# EAGLE design untitled (EAGLE 6.1)
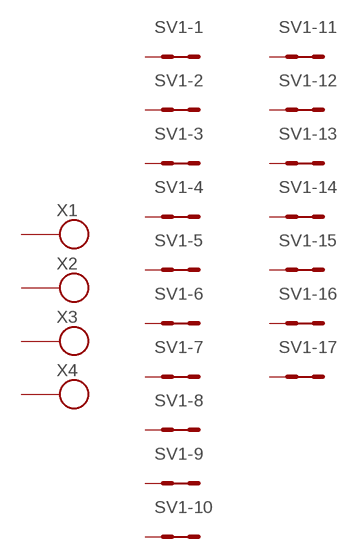
[diagram p0: schematic, sheet 1]

## Parts
SV1  MA17-2  [MA17-2]
X1  SROUB3M  [SROUB3M]
X2  SROUB3M  [SROUB3M]
X3  SROUB3M  [SROUB3M]
X4  SROUB3M  [SROUB3M]
Unconnected: SV1.1 SV1.2 SV1.3 SV1.4 SV1.5 SV1.6 SV1.7 SV1.8 SV1.9 SV1.10 SV1.11 SV1.12 SV1.13 SV1.14 SV1.15 SV1.16 SV1.17 SV1.18 SV1.19 SV1.20 SV1.21 SV1.22 SV1.23 SV1.24 SV1.25 SV1.26 SV1.27 SV1.28 SV1.29 SV1.30 SV1.31 SV1.32 SV1.33 SV1.34 X1.P$1 X2.P$1 X3.P$1 X4.P$1

## Library data of the parts
SV1 = moje_hrebinky:MA17-2: PIN HEADER; OC_FARNELL: unknown; OC_NEWARK: unknown
X1-X4 = moje:SROUB3M

## Board
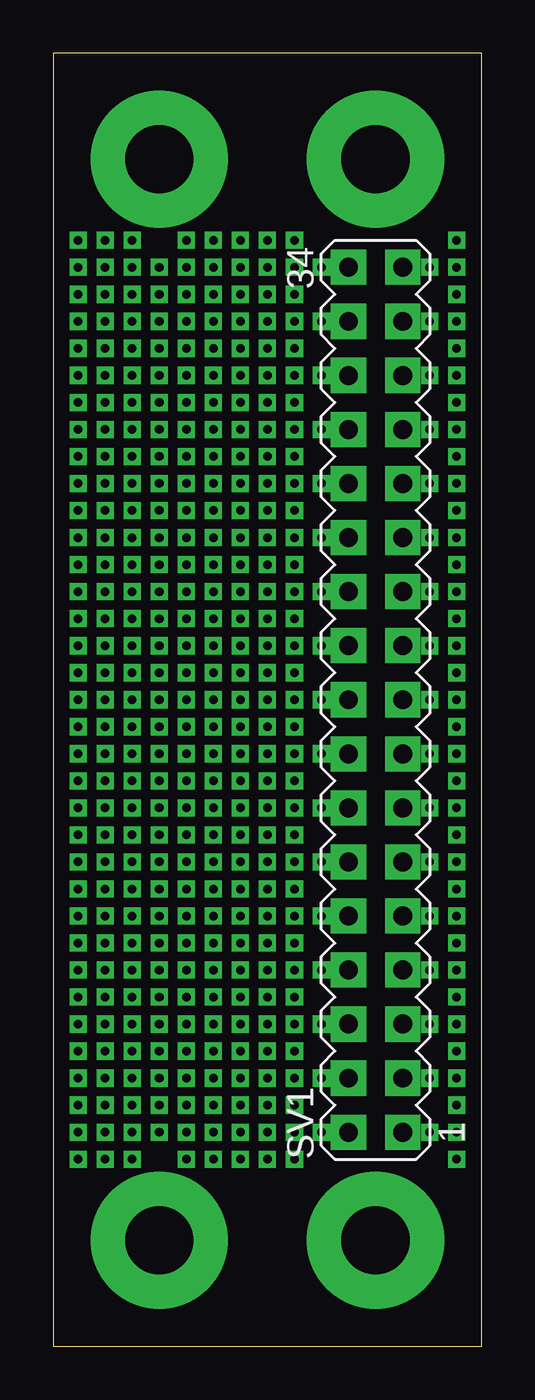
[diagram p1: board, top side]
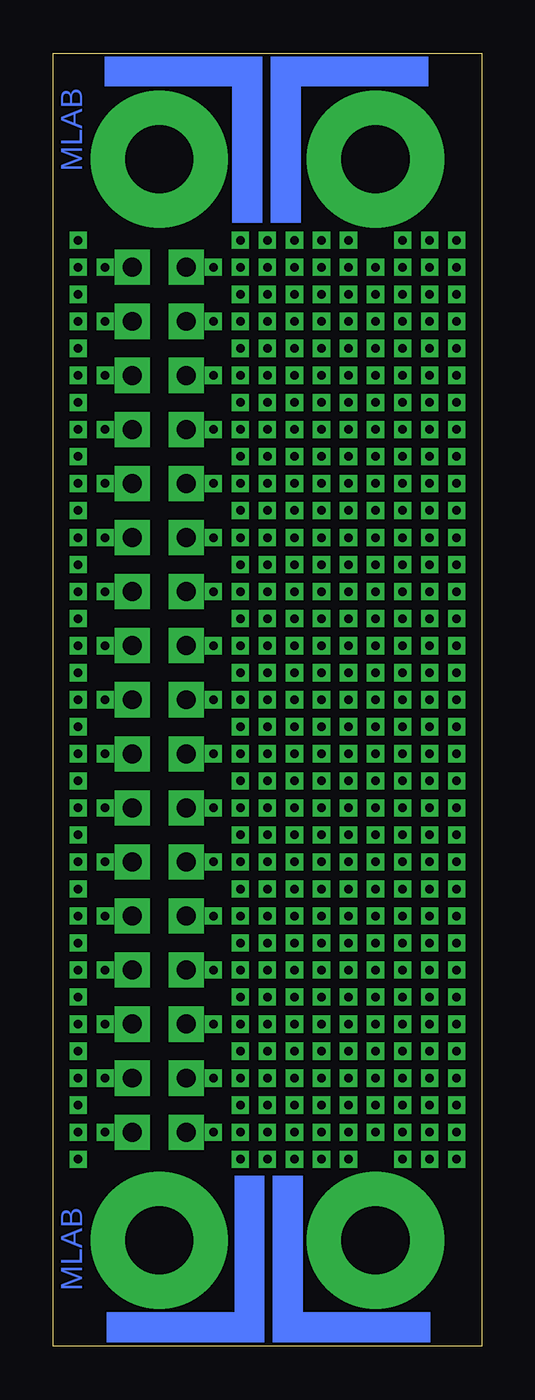
[diagram p2: board, bottom side, seen from below]

Size 20.12 x 60.76 mm. Coordinates in mm from the lower left corner, seen from the top.
Outline: 0,0 20.12,0 20.12,60.76 0,60.76 0,0
Copper layers (1*16): Top 0.035mm / dielectric 1.5mm / Bottom 0.035mm
Design rules: minimum track width 10mil, minimum drill 24mil, track to track 8mil, track to pad 8mil, pad to pad 8mil, via to via 8mil, smd to smd 8mil, copper to edge 40mil, drill to drill 8mil, minimum pad ring 10mil, minimum via ring 8mil, stop-mask expansion 4mil, vias tented up to drill 0mil, thermal gap 10mil

### Footprints (pad centres in the part's own frame; a part is rotated, then mirrored left to right if it is on the bottom)
MA17-2 = drill 0.889 pad 1.651 square: 1 -20.32,-1.27; 2 -20.32,1.27; 3 -17.78,-1.27; 4 -17.78,1.27; 5 -15.24,-1.27; 6 -15.24,1.27; 7 -12.7,-1.27; 8 -12.7,1.27; 9 -10.16,-1.27; 10 -10.16,1.27; 11 -7.62,-1.27; 12 -7.62,1.27; 13 -5.08,-1.27; 14 -5.08,1.27; 15 -2.54,-1.27; 16 -2.54,1.27; 17 0,-1.27; 18 0,1.27; 19 2.54,-1.27; 20 2.54,1.27; 21 5.08,-1.27; 22 5.08,1.27; 23 7.62,-1.27; 24 7.62,1.27; 25 10.16,-1.27; 26 10.16,1.27; 27 12.7,-1.27; 28 12.7,1.27; 29 15.24,-1.27; 30 15.24,1.27; 31 17.78,-1.27; 32 17.78,1.27; 33 20.32,-1.27; 34 20.32,1.27
SROUB3M = drill 3.2 pad 6.452: P$1 0,0

### Placement (x,y rotation side)
SV1  15.14,30.38 90 top
X1  15.14,4.98 0 top
X2  15.14,55.78 0 top
X3  4.98,4.98 0 top
X4  4.98,55.78 0 top

### Tracks (layer width: path | path; a pad name or v marks a point on that pad's centre or on a via)
N$1  (via drill 0.4)
  other vias: 3.71,8.79
N$2  (via drill 0.4)
  other vias: 6.25,8.79
N$3  (via drill 0.4)
  other vias: 7.52,8.79
N$4  (via drill 0.4)
  other vias: 8.79,8.79
N$5  (via drill 0.4)
  other vias: 10.06,8.79
N$6  (via drill 0.4)
  other vias: 11.33,8.79
N$7  (via drill 0.4)
  other vias: 11.33,10.06
N$8  (via drill 0.4)
  other vias: 10.06,10.06
N$9  (via drill 0.4)
  other vias: 8.79,10.06
N$10  (via drill 0.4)
  other vias: 1.17,8.79
N$11  (via drill 0.4)
  other vias: 2.44,8.79
N$12  (via drill 0.4)
  other vias: 7.52,10.06
N$13  (via drill 0.4)
  other vias: 6.25,10.06
N$14  (via drill 0.4)
  other vias: 4.98,10.06
N$15  (via drill 0.4)
  other vias: 3.71,10.06
N$16  (via drill 0.4)
  other vias: 2.44,10.06
N$17  (via drill 0.4)
  other vias: 1.17,10.06
N$18  (via drill 0.4)
  other vias: 1.17,11.33
N$19  (via drill 0.4)
  other vias: 2.44,11.33
N$20  (via drill 0.4)
  other vias: 3.71,11.33
N$21  (via drill 0.4)
  other vias: 4.98,11.33
N$22  (via drill 0.4)
  other vias: 6.25,11.33
N$23  (via drill 0.4)
  other vias: 7.52,11.33
N$24  (via drill 0.4)
  other vias: 8.79,11.33
N$25  (via drill 0.4)
  other vias: 10.06,11.33
N$26  (via drill 0.4)
  other vias: 11.33,11.33
N$27  (via drill 0.4)
  other vias: 11.33,12.6
N$28  (via drill 0.4)
  other vias: 10.06,12.6
N$29  (via drill 0.4)
  other vias: 8.79,12.6
N$30  (via drill 0.4)
  other vias: 7.52,12.6
N$31  (via drill 0.4)
  other vias: 4.98,12.6
N$32  (via drill 0.4)
  other vias: 6.25,12.6
N$33  (via drill 0.4)
  other vias: 3.71,12.6
N$34  (via drill 0.4)
  other vias: 2.44,12.6
N$35  (via drill 0.4)
  other vias: 1.17,12.6
N$36  (via drill 0.4)
  other vias: 12.6,12.6
N$37  (via drill 0.4)
  other vias: 12.6,10.06
N$38  (via drill 0.4)
  other vias: 11.33,13.87
N$39  (via drill 0.4)
  other vias: 10.06,13.87
N$40  (via drill 0.4)
  other vias: 8.79,13.87
N$41  (via drill 0.4)
  other vias: 7.52,13.87
N$42  (via drill 0.4)
  other vias: 6.25,13.87
N$43  (via drill 0.4)
  other vias: 3.71,13.87
N$44  (via drill 0.4)
  other vias: 4.98,13.87
N$45  (via drill 0.4)
  other vias: 2.44,13.87
N$46  (via drill 0.4)
  other vias: 1.17,13.87
N$47  (via drill 0.4)
  other vias: 11.33,15.14
N$48  (via drill 0.4)
  other vias: 10.06,15.14
N$49  (via drill 0.4)
  other vias: 8.79,15.14
N$50  (via drill 0.4)
  other vias: 7.52,15.14
N$51  (via drill 0.4)
  other vias: 6.25,15.14
N$52  (via drill 0.4)
  other vias: 4.98,15.14
N$53  (via drill 0.4)
  other vias: 3.71,15.14
N$54  (via drill 0.4)
  other vias: 2.44,15.14
N$55  (via drill 0.4)
  other vias: 1.17,15.14
N$56  (via drill 0.4)
  other vias: 1.17,16.41
N$57  (via drill 0.4)
  other vias: 2.44,16.41
N$58  (via drill 0.4)
  other vias: 3.71,16.41
N$59  (via drill 0.4)
  other vias: 4.98,16.41
N$60  (via drill 0.4)
  other vias: 6.25,16.41
N$61  (via drill 0.4)
  other vias: 7.52,16.41
N$62  (via drill 0.4)
  other vias: 8.79,16.41
N$63  (via drill 0.4)
  other vias: 10.06,16.41
N$64  (via drill 0.4)
  other vias: 11.33,16.41
N$65  (via drill 0.4)
  other vias: 11.33,17.68
N$66  (via drill 0.4)
  other vias: 10.06,17.68
N$67  (via drill 0.4)
  other vias: 8.79,17.68
N$68  (via drill 0.4)
  other vias: 7.52,17.68
N$69  (via drill 0.4)
  other vias: 4.98,17.68
N$70  (via drill 0.4)
  other vias: 6.25,17.68
N$71  (via drill 0.4)
  other vias: 3.71,17.68
N$72  (via drill 0.4)
  other vias: 2.44,17.68
N$73  (via drill 0.4)
  other vias: 1.17,17.68
N$74  (via drill 0.4)
  other vias: 12.6,17.68
N$75  (via drill 0.4)
  other vias: 12.6,15.14
N$76  (via drill 0.4)
  other vias: 11.33,18.95
N$77  (via drill 0.4)
  other vias: 10.06,18.95
N$78  (via drill 0.4)
  other vias: 8.79,18.95
N$79  (via drill 0.4)
  other vias: 7.52,18.95
N$80  (via drill 0.4)
  other vias: 6.25,18.95
N$81  (via drill 0.4)
  other vias: 3.71,18.95
N$82  (via drill 0.4)
  other vias: 4.98,18.95
N$83  (via drill 0.4)
  other vias: 2.44,18.95
N$84  (via drill 0.4)
  other vias: 1.17,18.95
N$85  (via drill 0.4)
  other vias: 11.33,20.22
N$86  (via drill 0.4)
  other vias: 10.06,20.22
N$87  (via drill 0.4)
  other vias: 8.79,20.22
N$88  (via drill 0.4)
  other vias: 7.52,20.22
N$89  (via drill 0.4)
  other vias: 6.25,20.22
N$90  (via drill 0.4)
  other vias: 4.98,20.22
N$91  (via drill 0.4)
  other vias: 3.71,20.22
N$92  (via drill 0.4)
  other vias: 2.44,20.22
N$93  (via drill 0.4)
  other vias: 1.17,20.22
N$94  (via drill 0.4)
  other vias: 1.17,21.49
N$95  (via drill 0.4)
  other vias: 2.44,21.49
N$96  (via drill 0.4)
  other vias: 3.71,21.49
N$97  (via drill 0.4)
  other vias: 4.98,21.49
N$98  (via drill 0.4)
  other vias: 6.25,21.49
N$99  (via drill 0.4)
  other vias: 7.52,21.49
N$100  (via drill 0.4)
  other vias: 8.79,21.49
N$101  (via drill 0.4)
  other vias: 10.06,21.49
N$102  (via drill 0.4)
  other vias: 11.33,21.49
N$103  (via drill 0.4)
  other vias: 11.33,22.76
N$104  (via drill 0.4)
  other vias: 10.06,22.76
N$105  (via drill 0.4)
  other vias: 8.79,22.76
N$106  (via drill 0.4)
  other vias: 7.52,22.76
N$107  (via drill 0.4)
  other vias: 4.98,22.76
N$108  (via drill 0.4)
  other vias: 6.25,22.76
N$109  (via drill 0.4)
  other vias: 3.71,22.76
N$110  (via drill 0.4)
  other vias: 2.44,22.76
N$111  (via drill 0.4)
  other vias: 1.17,22.76
N$112  (via drill 0.4)
  other vias: 12.6,22.76
N$113  (via drill 0.4)
  other vias: 12.6,20.22
N$114  (via drill 0.4)
  other vias: 11.33,24.03
N$115  (via drill 0.4)
  other vias: 10.06,24.03
N$116  (via drill 0.4)
  other vias: 8.79,24.03
N$117  (via drill 0.4)
  other vias: 7.52,24.03
N$118  (via drill 0.4)
  other vias: 6.25,24.03
N$119  (via drill 0.4)
  other vias: 3.71,24.03
N$120  (via drill 0.4)
  other vias: 4.98,24.03
N$121  (via drill 0.4)
  other vias: 2.44,24.03
N$122  (via drill 0.4)
  other vias: 1.17,24.03
N$123  (via drill 0.4)
  other vias: 11.33,25.3
N$124  (via drill 0.4)
  other vias: 10.06,25.3
N$125  (via drill 0.4)
  other vias: 8.79,25.3
N$126  (via drill 0.4)
  other vias: 7.52,25.3
N$127  (via drill 0.4)
  other vias: 6.25,25.3
N$128  (via drill 0.4)
  other vias: 4.98,25.3
N$129  (via drill 0.4)
  other vias: 3.71,25.3
N$130  (via drill 0.4)
  other vias: 2.44,25.3
N$131  (via drill 0.4)
  other vias: 1.17,25.3
N$132  (via drill 0.4)
  other vias: 1.17,26.57
N$133  (via drill 0.4)
  other vias: 2.44,26.57
N$134  (via drill 0.4)
  other vias: 3.71,26.57
N$135  (via drill 0.4)
  other vias: 4.98,26.57
N$136  (via drill 0.4)
  other vias: 6.25,26.57
N$137  (via drill 0.4)
  other vias: 7.52,26.57
N$138  (via drill 0.4)
  other vias: 8.79,26.57
N$139  (via drill 0.4)
  other vias: 10.06,26.57
N$140  (via drill 0.4)
  other vias: 11.33,26.57
N$141  (via drill 0.4)
  other vias: 11.33,27.84
N$142  (via drill 0.4)
  other vias: 10.06,27.84
N$143  (via drill 0.4)
  other vias: 8.79,27.84
N$144  (via drill 0.4)
  other vias: 7.52,27.84
N$145  (via drill 0.4)
  other vias: 4.98,27.84
N$146  (via drill 0.4)
  other vias: 6.25,27.84
N$147  (via drill 0.4)
  other vias: 3.71,27.84
N$148  (via drill 0.4)
  other vias: 2.44,27.84
N$149  (via drill 0.4)
  other vias: 1.17,27.84
N$150  (via drill 0.4)
  other vias: 12.6,27.84
N$151  (via drill 0.4)
  other vias: 12.6,25.3
N$152  (via drill 0.4)
  other vias: 11.33,29.11
N$153  (via drill 0.4)
  other vias: 10.06,29.11
N$154  (via drill 0.4)
  other vias: 8.79,29.11
N$155  (via drill 0.4)
  other vias: 7.52,29.11
N$156  (via drill 0.4)
  other vias: 6.25,29.11
N$157  (via drill 0.4)
  other vias: 3.71,29.11
N$158  (via drill 0.4)
  other vias: 4.98,29.11
N$159  (via drill 0.4)
  other vias: 2.44,29.11
N$160  (via drill 0.4)
  other vias: 1.17,29.11
N$161  (via drill 0.4)
  other vias: 11.33,30.38
N$162  (via drill 0.4)
  other vias: 10.06,30.38
N$163  (via drill 0.4)
  other vias: 8.79,30.38
N$164  (via drill 0.4)
  other vias: 7.52,30.38
N$165  (via drill 0.4)
  other vias: 6.25,30.38
N$166  (via drill 0.4)
  other vias: 4.98,30.38
N$167  (via drill 0.4)
  other vias: 3.71,30.38
N$168  (via drill 0.4)
  other vias: 2.44,30.38
N$169  (via drill 0.4)
  other vias: 1.17,30.38
N$170  (via drill 0.4)
  other vias: 1.17,31.65
N$171  (via drill 0.4)
  other vias: 2.44,31.65
N$172  (via drill 0.4)
  other vias: 3.71,31.65
N$173  (via drill 0.4)
  other vias: 4.98,31.65
N$174  (via drill 0.4)
  other vias: 6.25,31.65
N$175  (via drill 0.4)
  other vias: 7.52,31.65
N$176  (via drill 0.4)
  other vias: 8.79,31.65
N$177  (via drill 0.4)
  other vias: 10.06,31.65
N$178  (via drill 0.4)
  other vias: 11.33,31.65
N$179  (via drill 0.4)
  other vias: 11.33,32.92
N$180  (via drill 0.4)
  other vias: 10.06,32.92
N$181  (via drill 0.4)
  other vias: 8.79,32.92
N$182  (via drill 0.4)
  other vias: 7.52,32.92
N$183  (via drill 0.4)
  other vias: 4.98,32.92
N$184  (via drill 0.4)
  other vias: 6.25,32.92
N$185  (via drill 0.4)
  other vias: 3.71,32.92
N$186  (via drill 0.4)
  other vias: 2.44,32.92
N$187  (via drill 0.4)
  other vias: 1.17,32.92
N$188  (via drill 0.4)
  other vias: 12.6,32.92
N$189  (via drill 0.4)
  other vias: 12.6,30.38
N$190  (via drill 0.4)
  other vias: 11.33,34.19
N$191  (via drill 0.4)
  other vias: 10.06,34.19
N$192  (via drill 0.4)
  other vias: 8.79,34.19
N$193  (via drill 0.4)
  other vias: 7.52,34.19
N$194  (via drill 0.4)
  other vias: 6.25,34.19
N$195  (via drill 0.4)
  other vias: 3.71,34.19
N$196  (via drill 0.4)
  other vias: 4.98,34.19
N$197  (via drill 0.4)
  other vias: 2.44,34.19
N$198  (via drill 0.4)
  other vias: 1.17,34.19
N$199  (via drill 0.4)
  other vias: 11.33,35.46
N$200  (via drill 0.4)
  other vias: 10.06,35.46
N$201  (via drill 0.4)
  other vias: 8.79,35.46
N$202  (via drill 0.4)
  other vias: 7.52,35.46
N$203  (via drill 0.4)
  other vias: 6.25,35.46
N$204  (via drill 0.4)
  other vias: 4.98,35.46
N$205  (via drill 0.4)
  other vias: 3.71,35.46
N$206  (via drill 0.4)
  other vias: 2.44,35.46
N$207  (via drill 0.4)
  other vias: 1.17,35.46
N$208  (via drill 0.4)
  other vias: 1.17,36.73
N$209  (via drill 0.4)
  other vias: 2.44,36.73
N$210  (via drill 0.4)
  other vias: 3.71,36.73
N$211  (via drill 0.4)
  other vias: 4.98,36.73
N$212  (via drill 0.4)
  other vias: 6.25,36.73
N$213  (via drill 0.4)
  other vias: 7.52,36.73
N$214  (via drill 0.4)
  other vias: 8.79,36.73
N$215  (via drill 0.4)
  other vias: 10.06,36.73
N$216  (via drill 0.4)
  other vias: 11.33,36.73
N$217  (via drill 0.4)
  other vias: 11.33,38
N$218  (via drill 0.4)
  other vias: 10.06,38
N$219  (via drill 0.4)
  other vias: 8.79,38
N$220  (via drill 0.4)
  other vias: 7.52,38
N$221  (via drill 0.4)
  other vias: 4.98,38
N$222  (via drill 0.4)
  other vias: 6.25,38
N$223  (via drill 0.4)
  other vias: 3.71,38
N$224  (via drill 0.4)
  other vias: 2.44,38
N$225  (via drill 0.4)
  other vias: 1.17,38
N$226  (via drill 0.4)
  other vias: 12.6,38
N$227  (via drill 0.4)
  other vias: 12.6,35.46
N$228  (via drill 0.4)
  other vias: 11.33,39.27
N$229  (via drill 0.4)
  other vias: 10.06,39.27
N$230  (via drill 0.4)
  other vias: 8.79,39.27
N$231  (via drill 0.4)
  other vias: 7.52,39.27
N$232  (via drill 0.4)
  other vias: 6.25,39.27
N$233  (via drill 0.4)
  other vias: 3.71,39.27
N$234  (via drill 0.4)
  other vias: 4.98,39.27
N$235  (via drill 0.4)
  other vias: 2.44,39.27
N$236  (via drill 0.4)
  other vias: 1.17,39.27
N$237  (via drill 0.4)
  other vias: 11.33,40.54
N$238  (via drill 0.4)
  other vias: 10.06,40.54
N$239  (via drill 0.4)
  other vias: 8.79,40.54
N$240  (via drill 0.4)
  other vias: 7.52,40.54
N$241  (via drill 0.4)
  other vias: 6.25,40.54
N$242  (via drill 0.4)
  other vias: 4.98,40.54
N$243  (via drill 0.4)
  other vias: 3.71,40.54
N$244  (via drill 0.4)
  other vias: 2.44,40.54
N$245  (via drill 0.4)
  other vias: 1.17,40.54
N$246  (via drill 0.4)
  other vias: 1.17,41.81
N$247  (via drill 0.4)
  other vias: 2.44,41.81
N$248  (via drill 0.4)
  other vias: 3.71,41.81
N$249  (via drill 0.4)
  other vias: 4.98,41.81
N$250  (via drill 0.4)
  other vias: 6.25,41.81
N$251  (via drill 0.4)
  other vias: 7.52,41.81
N$252  (via drill 0.4)
  other vias: 8.79,41.81
N$253  (via drill 0.4)
  other vias: 10.06,41.81
N$254  (via drill 0.4)
  other vias: 11.33,41.81
N$255  (via drill 0.4)
  other vias: 11.33,43.08
N$256  (via drill 0.4)
  other vias: 10.06,43.08
N$257  (via drill 0.4)
  other vias: 8.79,43.08
N$258  (via drill 0.4)
  other vias: 7.52,43.08
N$259  (via drill 0.4)
  other vias: 4.98,43.08
N$260  (via drill 0.4)
  other vias: 6.25,43.08
N$261  (via drill 0.4)
  other vias: 3.71,43.08
N$262  (via drill 0.4)
  other vias: 2.44,43.08
N$263  (via drill 0.4)
  other vias: 1.17,43.08
N$264  (via drill 0.4)
  other vias: 12.6,43.08
N$265  (via drill 0.4)
  other vias: 12.6,40.54
N$266  (via drill 0.4)
  other vias: 11.33,44.35
N$267  (via drill 0.4)
  other vias: 10.06,44.35
N$268  (via drill 0.4)
  other vias: 8.79,44.35
N$269  (via drill 0.4)
  other vias: 7.52,44.35
N$270  (via drill 0.4)
  other vias: 6.25,44.35
N$271  (via drill 0.4)
  other vias: 3.71,44.35
N$272  (via drill 0.4)
  other vias: 4.98,44.35
N$273  (via drill 0.4)
  other vias: 2.44,44.35
N$274  (via drill 0.4)
  other vias: 1.17,44.35
N$275  (via drill 0.4)
  other vias: 11.33,45.62
N$276  (via drill 0.4)
  other vias: 10.06,45.62
N$277  (via drill 0.4)
  other vias: 8.79,45.62
N$278  (via drill 0.4)
  other vias: 7.52,45.62
N$279  (via drill 0.4)
  other vias: 6.25,45.62
N$280  (via drill 0.4)
  other vias: 4.98,45.62
N$281  (via drill 0.4)
  other vias: 3.71,45.62
N$282  (via drill 0.4)
  other vias: 2.44,45.62
N$283  (via drill 0.4)
  other vias: 1.17,45.62
N$284  (via drill 0.4)
  other vias: 1.17,46.89
N$285  (via drill 0.4)
  other vias: 2.44,46.89
N$286  (via drill 0.4)
  other vias: 3.71,46.89
N$287  (via drill 0.4)
  other vias: 4.98,46.89
N$288  (via drill 0.4)
  other vias: 6.25,46.89
N$289  (via drill 0.4)
  other vias: 7.52,46.89
N$290  (via drill 0.4)
  other vias: 8.79,46.89
N$291  (via drill 0.4)
  other vias: 10.06,46.89
N$292  (via drill 0.4)
  other vias: 11.33,46.89
N$293  (via drill 0.4)
  other vias: 11.33,48.16
N$294  (via drill 0.4)
  other vias: 10.06,48.16
N$295  (via drill 0.4)
  other vias: 8.79,48.16
N$296  (via drill 0.4)
  other vias: 7.52,48.16
N$297  (via drill 0.4)
  other vias: 4.98,48.16
N$298  (via drill 0.4)
  other vias: 6.25,48.16
N$299  (via drill 0.4)
  other vias: 3.71,48.16
N$300  (via drill 0.4)
  other vias: 2.44,48.16
N$301  (via drill 0.4)
  other vias: 1.17,48.16
N$302  (via drill 0.4)
  other vias: 12.6,48.16
N$303  (via drill 0.4)
  other vias: 12.6,45.62
N$304  (via drill 0.4)
  other vias: 11.33,49.43
N$305  (via drill 0.4)
  other vias: 10.06,49.43
N$306  (via drill 0.4)
  other vias: 8.79,49.43
N$307  (via drill 0.4)
  other vias: 7.52,49.43
N$308  (via drill 0.4)
  other vias: 6.25,49.43
N$309  (via drill 0.4)
  other vias: 3.71,49.43
N$310  (via drill 0.4)
  other vias: 4.98,49.43
N$311  (via drill 0.4)
  other vias: 2.44,49.43
N$312  (via drill 0.4)
  other vias: 1.17,49.43
N$313  (via drill 0.4)
  other vias: 1.17,50.7
N$314  (via drill 0.4)
  other vias: 3.71,50.7
N$315  (via drill 0.4)
  other vias: 2.44,50.7
N$316  (via drill 0.4)
  other vias: 6.25,50.7
N$317  (via drill 0.4)
  other vias: 4.98,50.7
N$318  (via drill 0.4)
  other vias: 8.79,50.7
N$319  (via drill 0.4)
  other vias: 7.52,50.7
N$320  (via drill 0.4)
  other vias: 10.06,50.7
N$321  (via drill 0.4)
  other vias: 11.33,50.7
N$322  (via drill 0.4)
  other vias: 11.33,51.97
N$323  (via drill 0.4)
  other vias: 10.06,51.97
N$324  (via drill 0.4)
  other vias: 7.52,51.97
N$325  (via drill 0.4)
  other vias: 8.79,51.97
N$326  (via drill 0.4)
  other vias: 6.25,51.97
N$327  (via drill 0.4)
  other vias: 12.6,50.7
N$328  (via drill 0.4)
  other vias: 3.71,51.97
N$329  (via drill 0.4)
  other vias: 2.44,51.97
N$330  (via drill 0.4)
  other vias: 1.17,51.97
N$357  (via drill 0.4)
  other vias: 18.95,8.79
N$371  (via drill 0.4)
  other vias: 18.95,45.62
N$383  (via drill 0.4)
  other vias: 18.95,10.06
N$385  (via drill 0.4)
  other vias: 18.95,12.6
N$386  (via drill 0.4)
  other vias: 18.95,11.33
N$387  (via drill 0.4)
  other vias: 18.95,13.87
N$388  (via drill 0.4)
  other vias: 18.95,15.14
N$389  (via drill 0.4)
  other vias: 17.68,15.14
N$390  (via drill 0.4)
  other vias: 17.68,12.6
N$391  (via drill 0.4)
  other vias: 17.68,10.06
N$392  (via drill 0.4)
  other vias: 17.68,17.68
N$393  (via drill 0.4)
  other vias: 17.68,20.22
N$394  (via drill 0.4)
  other vias: 17.68,22.76
N$395  (via drill 0.4)
  other vias: 17.68,25.3
N$396  (via drill 0.4)
  other vias: 17.68,27.84
N$397  (via drill 0.4)
  other vias: 17.68,30.38
N$398  (via drill 0.4)
  other vias: 17.68,32.92
N$399  (via drill 0.4)
  other vias: 17.68,35.46
N$400  (via drill 0.4)
  other vias: 17.68,38
N$401  (via drill 0.4)
  other vias: 17.68,40.54
N$402  (via drill 0.4)
  other vias: 17.68,43.08
N$403  (via drill 0.4)
  other vias: 17.68,45.62
N$404  (via drill 0.4)
  other vias: 17.68,48.16
N$405  (via drill 0.4)
  other vias: 17.68,50.7
N$408  (via drill 0.4)
  other vias: 18.95,43.08
N$409  (via drill 0.4)
  other vias: 18.95,51.97
N$410  (via drill 0.4)
  other vias: 18.95,50.7
N$411  (via drill 0.4)
  other vias: 18.95,49.43
N$412  (via drill 0.4)
  other vias: 18.95,46.89
N$413  (via drill 0.4)
  other vias: 18.95,48.16
N$414  (via drill 0.4)
  other vias: 18.95,44.35
N$415  (via drill 0.4)
  other vias: 18.95,16.41
N$416  (via drill 0.4)
  other vias: 18.95,17.68
N$417  (via drill 0.4)
  other vias: 18.95,18.95
N$418  (via drill 0.4)
  other vias: 18.95,20.22
N$419  (via drill 0.4)
  other vias: 18.95,21.49
N$420  (via drill 0.4)
  other vias: 18.95,22.76
N$421  (via drill 0.4)
  other vias: 18.95,25.3
N$422  (via drill 0.4)
  other vias: 18.95,24.03
N$423  (via drill 0.4)
  other vias: 18.95,26.57
N$424  (via drill 0.4)
  other vias: 18.95,27.84
N$425  (via drill 0.4)
  other vias: 18.95,29.11
N$426  (via drill 0.4)
  other vias: 18.95,31.65
N$427  (via drill 0.4)
  other vias: 18.95,30.38
N$428  (via drill 0.4)
  other vias: 18.95,32.92
N$429  (via drill 0.4)
  other vias: 18.95,34.19
N$430  (via drill 0.4)
  other vias: 18.95,36.73
N$431  (via drill 0.4)
  other vias: 18.95,35.46
N$432  (via drill 0.4)
  other vias: 18.95,38
N$433  (via drill 0.4)
  other vias: 18.95,39.27
N$434  (via drill 0.4)
  other vias: 18.95,40.54
N$435  (via drill 0.4)
  other vias: 18.95,41.81
(copper drawn outside any net)
  shapes: Bottom area x8

### Text on the board
Bottom: MLAB | MLAB